# EAGLE design Sonar_Power_Schematic_LT1962 (EAGLE 8.4.0)
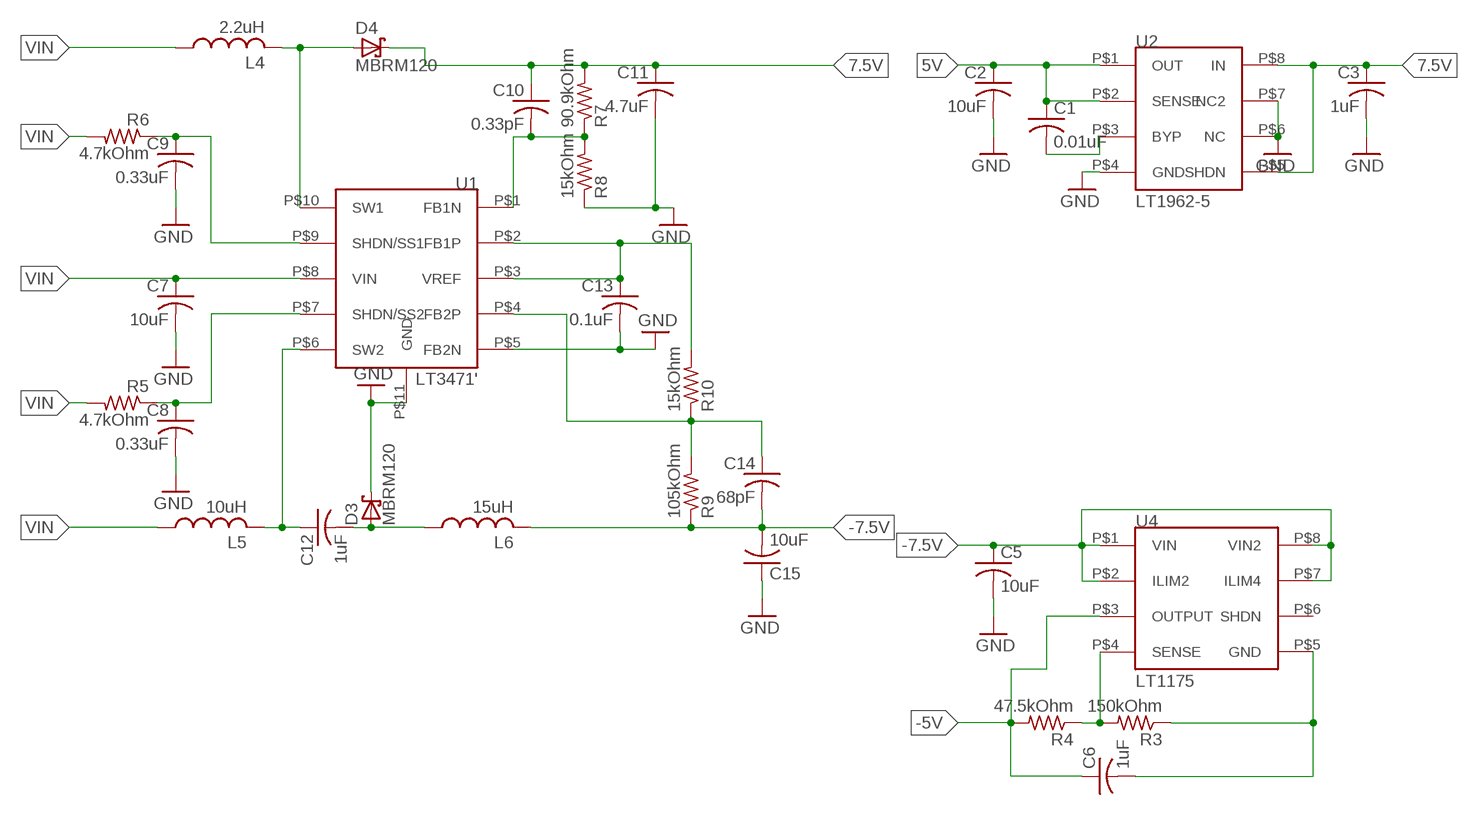
[diagram p0: schematic, sheet 1]

## Parts
C1  0.01uF  C-USC0603  [C0603]
C2  10uF  C-USC0603  [C0603]
C3  1uF  C-USC0603  [C0603]
C5  10uF  C-USC0603  [C0603]
C6  1uF  C-USC0603  [C0603]
C7  10uF  C-USC0603  [C0603]
C8  0.33uF  C-USC0603  [C0603]
C9  0.33uF  C-USC0603  [C0603]
C10  0.33pF  C-USC0603  [C0603]
C11  4.7uF  C-USC0603  [C0603]
C12  1uF  C-USC0603  [C0603]
C13  0.1uF  C-USC0603  [C0603]
C14  68pF  C-USC0603  [C0603]
C15  10uF  C-USC0603  [C0603]
D3  MBRM120  [DO-216AA]
D4  MBRM120  [DO-216AA]
L4  2.2uH  LQH5BPN2R2N38L  [NS4.9X4.9]
L5  10uH  VLS5045EX-100M2  [NS5X5]
L6  15uH  VLS5045EX-150M-CA1  [NS5X5]
R3  150kOhm  R-US_R0603  [R0603]
R4  47.5kOhm  R-US_R0603  [R0603]
R5  4.7kOhm  R-US_R0603  [R0603]
R6  4.7kOhm  R-US_R0603  [R0603]
R7  90.9kOhm  R-US_R0603  [R0603]
R8  15kOhm  R-US_R0603  [R0603]
R9  105kOhm  R-US_R0603  [R0603]
R10  15kOhm  R-US_R0603  [R0603]
U1  LT3471'  [10-WFDFN]
U2  LT1962-5  [8-MSOP]
U4  LT1175  [8-SOIC]

## Nets
5V: C1.1 C2.1 U2.P$1(OUT) U2.P$2(SENSE)
7.5V: C3.1 C10.1 C11.1 D4.P$1(C) R7.2 U2.P$5(SHDN) U2.P$8(IN)
-5V: C6.1 R4.2 U4.P$3(OUTPUT)
-7.5V: C5.1 C14.2 C15.2 L6.P$2 R9.1 U4.P$1(VIN) U4.P$2(ILIM2) U4.P$7(ILIM4) U4.P$8(VIN2)
GND: C2.2 C3.2 C5.2 C7.2 C8.2 C9.2 C11.2 C13.2 C15.1 D3.P$1(C) R8.1 U1.P$5(FB2N) U1.P$11(GND) U2.P$4(GND) U2.P$6(NC) U2.P$7(NC2)
N$4: C1.2 U2.P$3(BYP)
N$9: R3.2 R4.1 U4.P$4(SENSE)
N$10: C6.2 R3.1 U4.P$5(GND)
N$17: D4.P$2(A) L4.P$2 U1.P$10(SW1)
N$18: C10.2 R7.1 R8.2 U1.P$1(FB1N)
N$20: C12.1 L5.P$2 U1.P$6(SW2)
N$21: C12.2 D3.P$2(A) L6.P$1
N$26: C14.1 R9.2 R10.1 U1.P$4(FB2P)
SS1: C9.1 R6.1 U1.P$9(SHDN/SS1)
SS2: C8.1 R5.1 U1.P$7(SHDN/SS2)
VIN: C7.1 L4.P$1 L5.P$1 R5.2 R6.2 U1.P$8(VIN)
VREF: C13.1 R10.2 U1.P$2(FB1P) U1.P$3(VREF)
Unconnected: U4.P$6(SHDN)

## Library data of the parts
C1-C3 C5-C15 = adafruit:C-US: CAPACITOR, American symbol
D3 D4 = Moira:MBRM120
L4 = Moira:LQH5BPN2R2N38L: 2.2uH
L5 = Moira:VLS5045EX-100M: VLS5045EX-100M, TDK 10uH, 445-174843-1-ND
L6 = Moira:VLS5045EX-150M-CA: VLS5045EX-150M-CA, TDK 15uH, 445-175141-1-ND
R3-R10 = adafruit:R-US_: RESISTOR, American symbol
U1 = Moira:LT3471: LT3471EDD#TRPBF
U2 = Moira:LT1962-5
U4 = Moira:LT1175: LT1175IS8#PBF

## Board
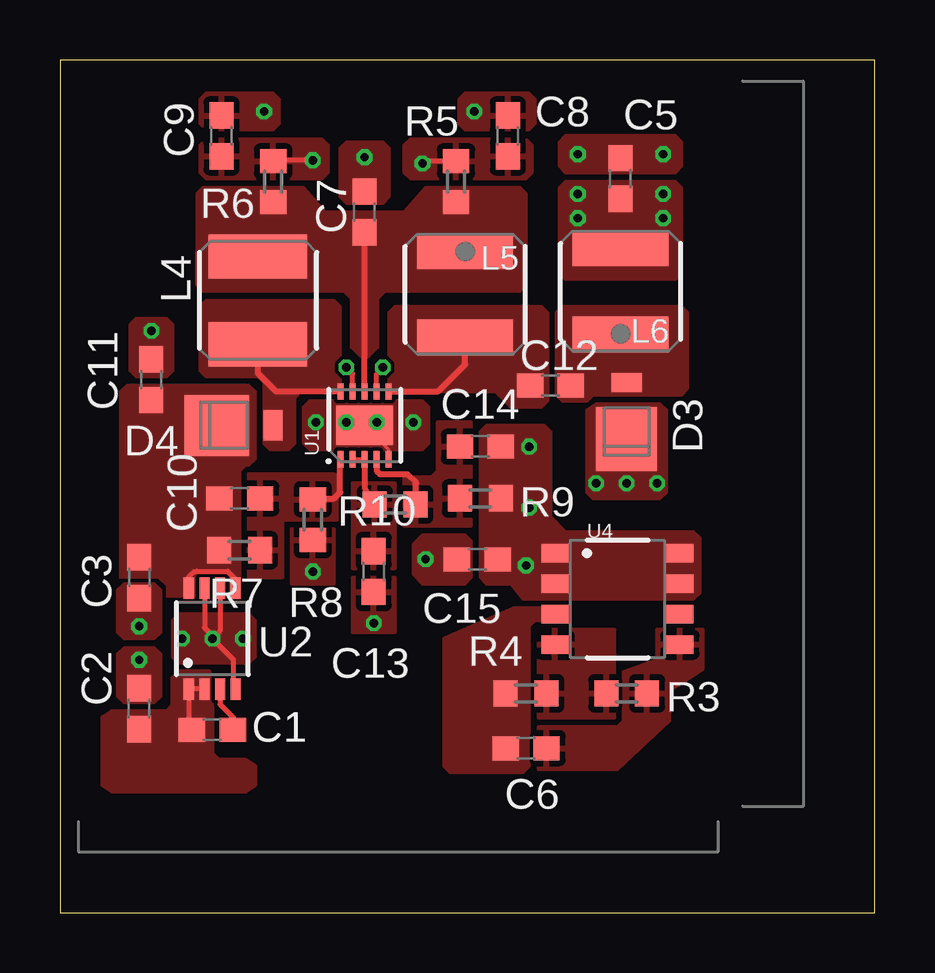
[diagram p1: board, top side]
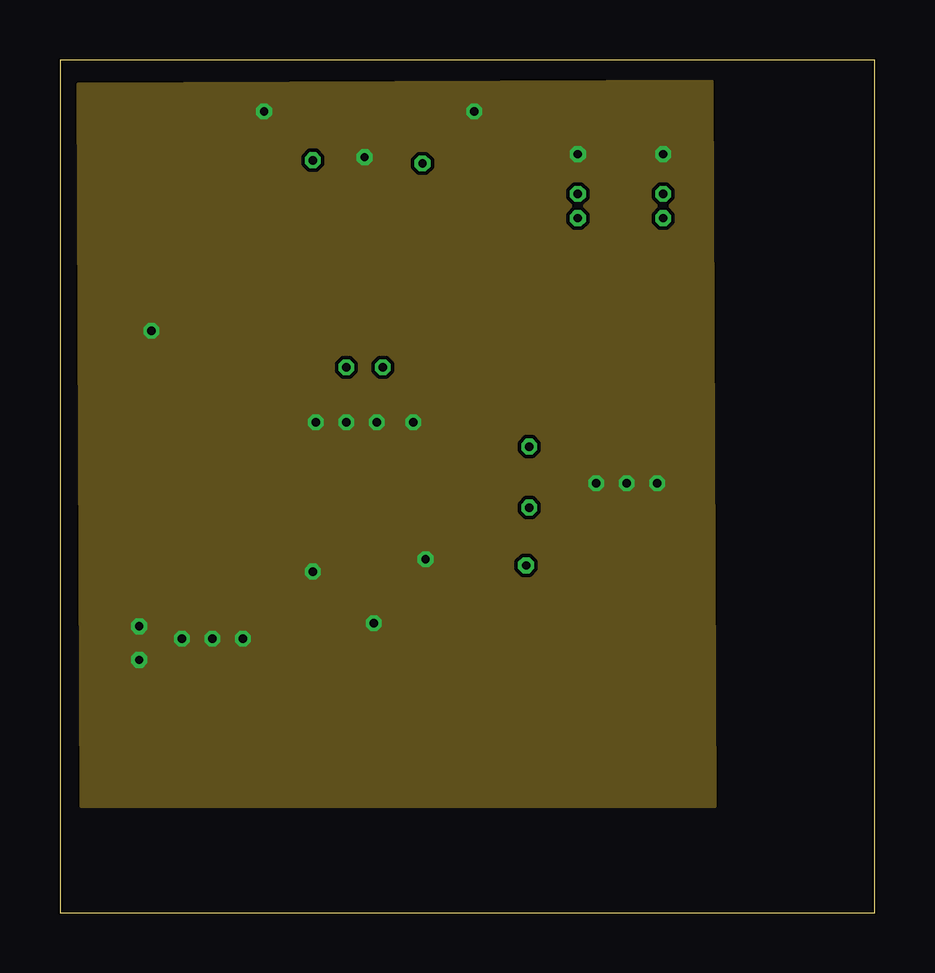
[diagram p2: board, inner layer Route2]
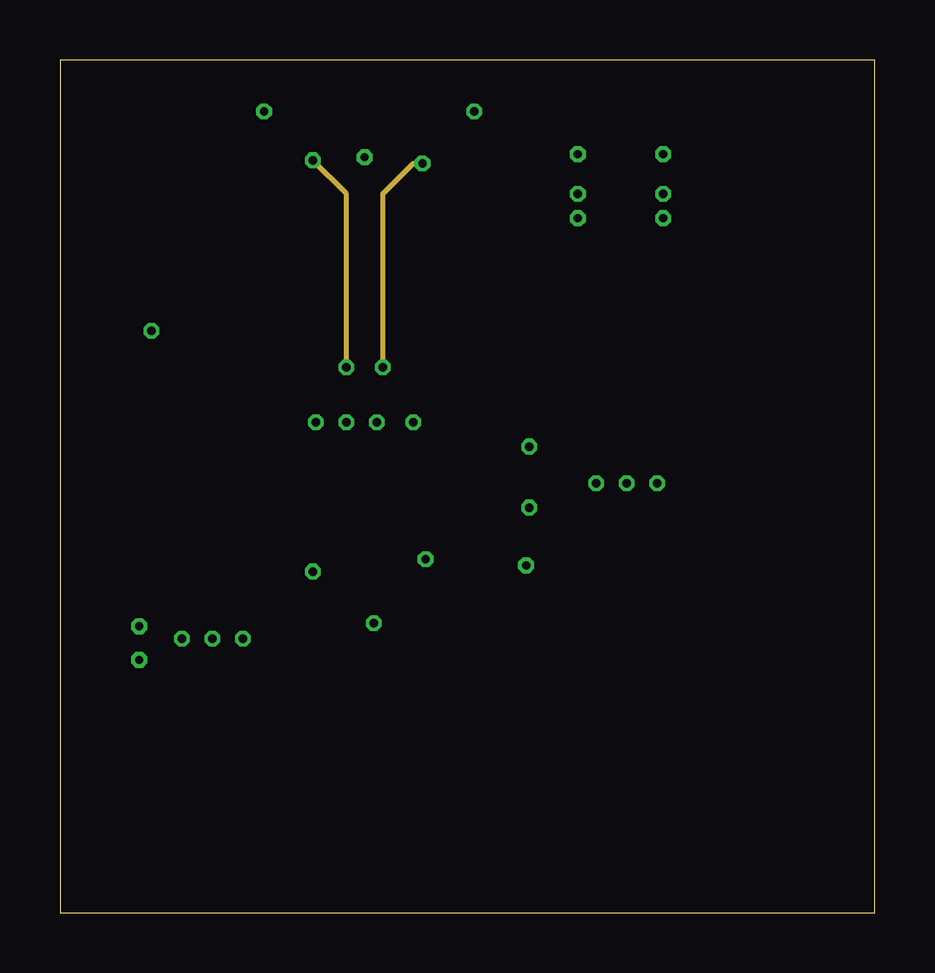
[diagram p3: board, inner layer Route15]
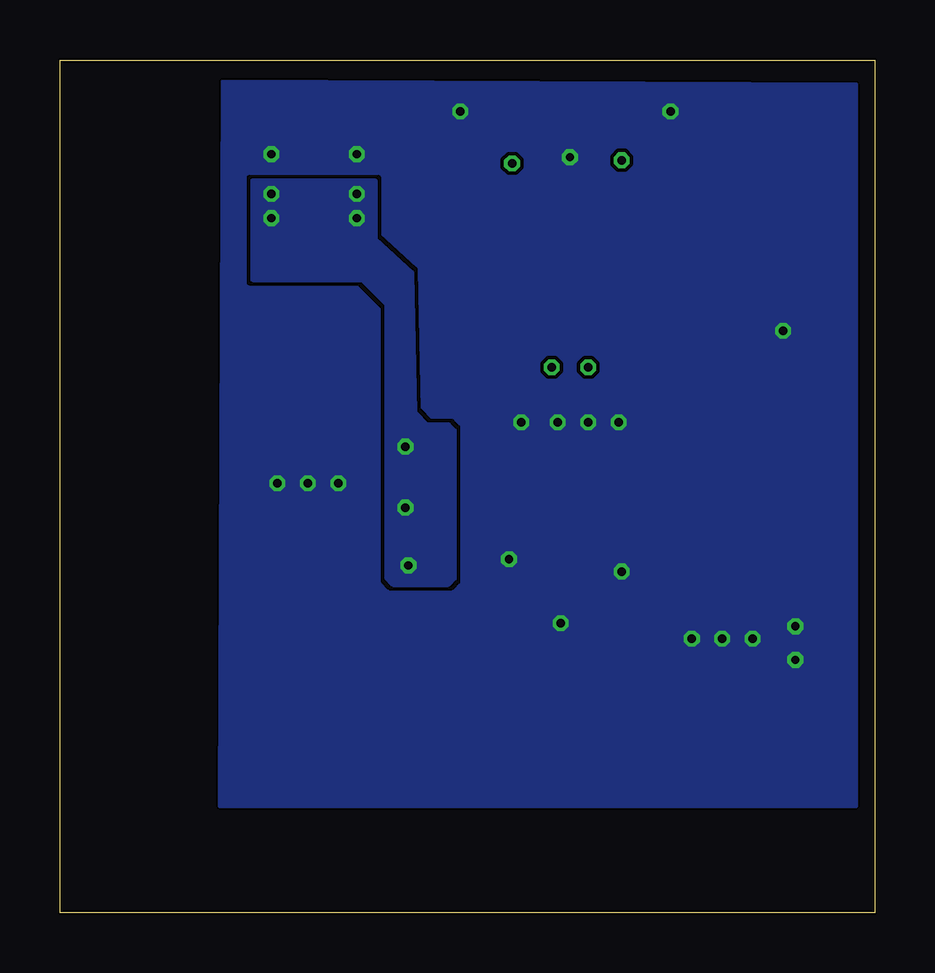
[diagram p4: board, bottom side, seen from below]

Size 33.96 x 35.55 mm. Coordinates in mm from the lower left corner, seen from the top.
Outline: 0,0 33.96,0 33.96,35.55 0,35.55 0,0
Copper layers (1*2*15*16): Top 0.035mm / dielectric 0.1702mm / Route2 0.0175mm / dielectric 47mil / Route15 0.0175mm / dielectric 0.1702mm / Bottom 0.035mm
Design rules "JLCPCB4Layer": minimum track width 6mil, minimum drill 10mil, track to track 6mil, track to pad 6mil, pad to pad 6mil, via to via 6mil, smd to smd 0mil, copper to edge 10mil, drill to drill 10mil, minimum pad ring 6mil, minimum via ring 6mil, stop-mask expansion 2mil, vias tented up to drill 100mil, thermal gap 10mil

### Footprints (pad centres in the part's own frame; a part is rotated, then mirrored left to right if it is on the bottom)
C0603 = smd 1.1 x 1: 1 -0.85,0; 2 0.85,0
DO-216AA = smd 2.67 x 2.54: P$1 -0.699,0 | smd 0.8 x 1.27: P$2 1.653,0
NS4.9X4.9 = smd 1.85 x 4.1: P$1 -1.825,0; P$2 1.825,0
NS5X5 = smd 1.5 x 4: P$1 -1.8,0; P$2 1.8,0
R0603 = smd 1 x 1.1: 1 -0.85,0; 2 0.85,0
10-WFDFN = smd 0.675 x 0.25: P$1 -1.413,1; P$2 -1.413,0.5; P$3 -1.413,0; P$4 -1.413,-0.5; P$5 -1.413,-1; P$6 1.413,-1; P$7 1.413,-0.5; P$8 1.413,0; P$9 1.413,0.5; P$10 1.413,1 | smd 1.65 x 2.38: P$11 0,0
8-MSOP = smd 0.42 x 0.889: P$1 -0.975,-2.106; P$2 -0.325,-2.106; P$3 0.325,-2.106; P$4 0.975,-2.106; P$5 -0.975,2.106; P$6 -0.325,2.106; P$7 0.325,2.106; P$8 0.975,2.106
8-SOIC = smd 1.143 x 0.762: P$1 -2.603,1.905; P$2 -2.603,0.635; P$3 -2.603,-0.635; P$4 -2.603,-1.905; P$5 2.603,-1.905; P$6 2.603,-0.635; P$7 2.603,0.635; P$8 2.603,1.905

### Placement (x,y rotation side)
C1  6.35,7.62 0 top
C2  3.3,8.51 90 top
C3  3.3,13.97 270 top
C5  23.37,30.61 90 top
C6  19.43,6.86 0 top
C7  12.7,29.21 90 top
C8  18.67,32.39 90 top
C9  6.73,32.39 90 top
C10  7.49,17.27 0 top
C11  3.81,22.23 90 top
C12  20.45,21.97 0 top
C13  13.08,14.22 270 top
C14  17.53,19.43 0 top
C15  17.4,14.73 0 top
D3  23.62,20.45 90 top
D4  7.24,20.32 0 top
L4  8.25,25.53 270 top
L5  16.89,25.78 270 top
L6  23.37,25.91 90 top
R3  23.62,9.14 180 top
R4  19.43,9.14 180 top
R5  16.51,30.48 270 top
R6  8.89,30.48 270 top
R7  7.49,15.11 180 top
R8  10.54,16.38 90 top
R9  17.53,17.27 180 top
R10  13.97,17.02 180 top
U1  12.7,20.32 90 top
U2  6.35,11.43 0 top
U4  23.24,13.08 0 top

### Tracks (layer width: path | path; a pad name or v marks a point on that pad's centre or on a via)
5V
  Top 0.203: U2.P$2 U2.P$1 5.37,7.75 C1.1
  pour Top (no thermals): 2.16,5.08 7.75,5.08 8.13,5.33 8.13,6.1 7.75,6.35 6.6,6.35 6.35,6.6 6.35,9.78 6.22,9.91 6.22,10.03 4.95,10.03 4.7,9.78 4.7,8.64 4.44,8.38 2.16,8.38 1.78,8.13 1.78,5.33
7.5V
  Top 0.203: U2.P$5 5.37,14.01 5.59,14.22 5.7,14.22 5.71,14.23 6.99,14.23 7.32,13.9 U2.P$8
  pour Top (rank 2, no thermals): 7.87,21.97 2.79,21.97 2.54,21.72 2.54,13.46 2.79,13.21 7.24,13.21 7.49,13.46 7.49,18.41 7.75,18.67 7.87,18.67 8.13,18.92 8.13,21.72
-5V
  pour Top (no thermals): 21.21,12.7 18.92,12.7 16,11.43 16,6.1 16.26,5.84 19.3,5.84 19.56,6.1 19.56,11.94 19.81,12.19 21.21,12.19
-7.5V  (via drill 0.35)
  other vias: 19.56,19.43 21.59,29.97 25.15,29.97 19.43,14.48 19.56,16.89 21.59,28.96 25.15,28.96
  pour Top (no thermals): 19.43,15.88 19.43,13.08 26.42,13.08 26.67,13.34 26.67,15.62 26.42,15.88
  pour Top (no thermals): 20.83,30.23 20.83,26.67 21.08,26.42 25.65,26.42 25.91,26.67 25.91,30.23 25.65,30.48 21.08,30.48
  pour Top (no thermals): 17.53,20.07 17.53,13.97 17.78,13.72 18.8,13.72 19.3,13.08 21.08,13.08 21.08,15.88 20.45,16.51 20.45,20.07 20.19,20.32 17.78,20.32
  pour Bottom (no thermals): 20.83,28.07 20.83,30.48 25.91,30.48 25.91,26.42 21.34,26.42 20.32,25.4 20.32,13.97 20.07,13.72 17.78,13.72 17.53,13.97 17.53,20.07 17.78,20.32 18.67,20.32 19.18,20.83 19.3,26.67
GND  (via drill 0.35)
  Top 0.152: U1.P$5 13.7,19.32 U1.P$11
  Top 0.203: U2.P$4 7.24,9.41 7.24,10.54 v6.35,11.43 6.41,11.49 | U2.P$7 6.67,11.76 6.41,11.49 | U2.P$6 6.02,11.88 6.41,11.49
  other vias: 15.24,14.73 12.7,31.5 10.67,20.45 14.73,20.45 10.54,14.22 8.51,33.4 13.08,12.07 17.27,33.4 21.59,31.62 25.15,31.62 3.81,24.26 23.62,17.91 11.94,20.45 13.21,20.45 22.35,17.91 24.89,17.91 5.08,11.43 7.62,11.43 3.3,10.54 3.3,11.94
  pour Top (no thermals): 11.94,32.13 11.68,31.88 11.68,29.84 11.94,29.59 13.46,29.59 13.72,29.84 13.72,31.88 13.46,32.13
  pour Top (no thermals): 17.14,13.97 17.14,15.49 16.89,15.75 15.11,15.75 14.73,15.37 14.73,14.1 15.11,13.72 16.89,13.72
  pour Route2: 0.76,34.54 27.18,34.67 27.3,4.45 0.89,4.45
  pour Top (no thermals): 10.16,21.08 10.16,19.56 10.41,19.3 15.11,19.3 15.37,19.56 15.37,21.08 15.11,21.34 10.41,21.34
  pour Top: 9.65,16 11.43,16 11.43,13.72 9.65,13.72
  pour Top: 5.84,33.91 5.84,32.89 6.1,32.64 8.89,32.64 9.14,32.89 9.14,33.91 8.89,34.16 6.1,34.16
  pour Top: 12.19,13.97 12.19,11.68 13.97,11.68 13.97,13.97
  pour Bottom (rank 2): 0.76,34.54 0.76,4.45 27.3,4.45 27.18,34.67
  pour Top: 16.89,34.16 16.64,33.91 16.64,32.89 16.89,32.64 19.56,32.64 19.81,32.89 19.81,33.91 19.56,34.16
  pour Top (no thermals): 25.91,31.12 25.91,32.13 25.65,32.39 21.08,32.39 20.83,32.13 20.83,31.12 21.08,30.86 25.65,30.86
  pour Top (no thermals): 3.17,24.77 4.44,24.77 4.7,24.51 4.7,22.61 4.44,22.35 3.17,22.35 2.92,22.61 2.92,24.51
  pour Top (no thermals): 21.97,20.96 22.35,21.21 25.02,21.21 25.27,20.96 25.27,17.53 25.02,17.27 22.23,17.27 21.97,17.53
  pour Top (no thermals): 8.13,10.67 8.13,12.19 7.87,12.45 4.95,12.45 4.7,12.19 4.7,10.67 4.95,10.41 7.87,10.41
  pour Top (no thermals): 3.94,8.76 2.67,8.76 2.41,9.02 2.41,10.79 2.67,11.05 3.94,11.05 4.19,10.79 4.19,9.02
  pour Top (no thermals): 3.94,11.43 2.67,11.43 2.41,11.68 2.41,13.46 2.67,13.72 3.94,13.72 4.19,13.46 4.19,11.68
N$4
  Top 0.203: U2.P$3 6.67,8.69 7.24,8.13 7.2,8.09 C1.2
N$9
  pour Top: 19.94,8.13 23.11,8.13 23.11,11.81 19.94,11.81
N$10
  pour Top: 23.24,7.75 23.49,8 23.49,10.03 24.89,10.54 24.89,11.81 26.8,11.81 26.8,10.16 25.4,9.27 25.4,8 23.24,5.97 19.94,5.97 19.94,7.75
N$17
  Top 0.254: U1.P$10 9,21.73 8.25,22.48 L4.P$2
  pour Top (no thermals): 11.68,25.27 11.68,21.97 11.43,21.72 10.03,21.72 9.78,21.46 9.78,19.56 9.52,19.3 8.76,19.3 8.51,19.56 8.51,22.1 8.25,22.35 6.1,22.35 5.84,22.61 5.84,25.27 6.1,25.53 11.43,25.53
N$18
  Top 0.254: R8.2 10.58,17.27 11.43,17.27 11.68,17.53 11.68,18.89 U1.P$1
  pour Top: 7.87,18.29 7.87,13.97 9.27,13.97 9.27,16.38 11.56,16.38 11.56,18.29
N$20
  Top 0.254: U1.P$6 15.76,21.73 16.89,22.86 L5.P$2
  pour Top (no thermals): 20.32,25.02 20.32,21.34 20.07,21.08 18.8,21.08 18.16,21.72 13.97,21.72 13.72,21.97 13.72,25.02 13.97,25.27 20.07,25.27
N$21
  pour Top (no thermals): 20.7,25.02 20.7,21.59 20.95,21.34 21.97,21.34 22.23,21.59 25.91,21.59 26.16,21.84 26.16,25.02 25.91,25.27 20.95,25.27
N$26
  Top 0.254: U1.P$4 13.21,18.41 13.33,18.29 14.48,18.29 14.86,17.91 14.82,17.87 R10.1
  pour Top: 14.35,18.16 14.35,16.13 17.14,16.13 17.14,20.45 15.75,20.45 15.75,18.41 15.49,18.16
SS1  (via drill 0.35)
  Top 0.203: U1.P$9 12.2,22.47 v11.94,22.73 | v10.54,31.37 8.93,31.37 R6.1
  Route15 0.203: v11.94,22.73 11.94,29.97 v10.54,31.37
  pour Top: 6.1,32.26 5.84,32 5.84,30.86 6.1,30.61 10.92,30.61 11.18,30.86 11.18,32 10.92,32.26
SS2  (via drill 0.35)
  Top 0.203: U1.P$7 13.2,22.47 v13.46,22.73 | R5.1 15.2,31.33 v15.11,31.24
  Route15 0.203: v13.46,22.73 13.46,29.97 14.73,31.24 v15.11,31.24
  pour Top: 14.35,32 14.35,30.86 14.6,30.61 19.43,30.61 19.68,30.86 19.68,32 19.43,32.26 14.6,32.26
VIN
  Top 0.254: U1.P$8 C7.1
  pour Top (no thermals): 5.71,29.97 5.71,26.16 5.97,25.91 19.18,25.91 19.43,26.29 19.43,29.97 19.18,30.23 15.24,30.23 14.35,29.21 11.05,29.21 10.16,30.23 5.97,30.23
  pour Top: 12.19,25.65 12.19,23.62 12.57,23.24 12.83,23.24 13.21,23.62 13.21,25.65 13.59,26.04 13.59,28.96 11.94,28.96 11.81,28.83 11.81,26.04
VREF
  Top 0.152: U1.P$2 U1.P$3
  Top 0.254: U1.P$3 12.7,17.69 R10.2
  pour Top: 12.19,17.91 12.19,14.35 13.97,14.35 13.97,17.91